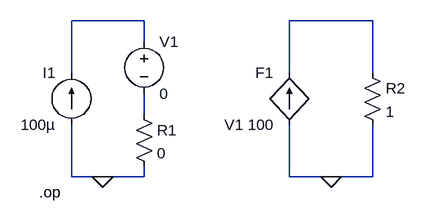
[diagram p0: schematic currentDependentCurrentSource.asc]
currentDependentCurrentSource.asc, the LTspice schematic file:
Version 4
SHEET 1 880 680
WIRE -16 48 -128 48
WIRE 336 48 208 48
WIRE -16 80 -16 48
WIRE -128 128 -128 48
WIRE 208 128 208 48
WIRE 336 128 336 48
WIRE -16 192 -16 160
WIRE -128 288 -128 208
WIRE -80 288 -128 288
WIRE -16 288 -16 272
WIRE -16 288 -80 288
WIRE 208 288 208 208
WIRE 272 288 208 288
WIRE 336 288 336 208
WIRE 336 288 272 288
FLAG -80 288 0
FLAG 272 288 0
SYMBOL f 208 208 R180
WINDOW 0 24 80 Left 2
WINDOW 3 24 0 Left 2
SYMATTR InstName F1
SYMATTR Value V1 100
SYMBOL voltage -16 64 R0
SYMATTR InstName V1
SYMATTR Value 0
SYMBOL res -32 176 R0
SYMATTR InstName R1
SYMATTR Value 0
SYMBOL current -128 208 R180
WINDOW 0 24 80 Left 2
WINDOW 3 24 0 Left 2
SYMATTR InstName I1
SYMATTR Value 100µ
SYMBOL res 320 112 R0
SYMATTR InstName R2
SYMATTR Value 1
TEXT -178 312 Left 2 !.op

The netlist it stands for:
* currentDependentCurrentSource.asc
F1 0 N002 V1 100
V1 N001 N003 0
R1 N003 0 0
I1 0 N001 100µ
R2 N002 0 1
.op
.backanno
.end